# EAGLE schematic Battery Buddy Schematic V1 (NO STORAGE) (EAGLE 9.7.0)
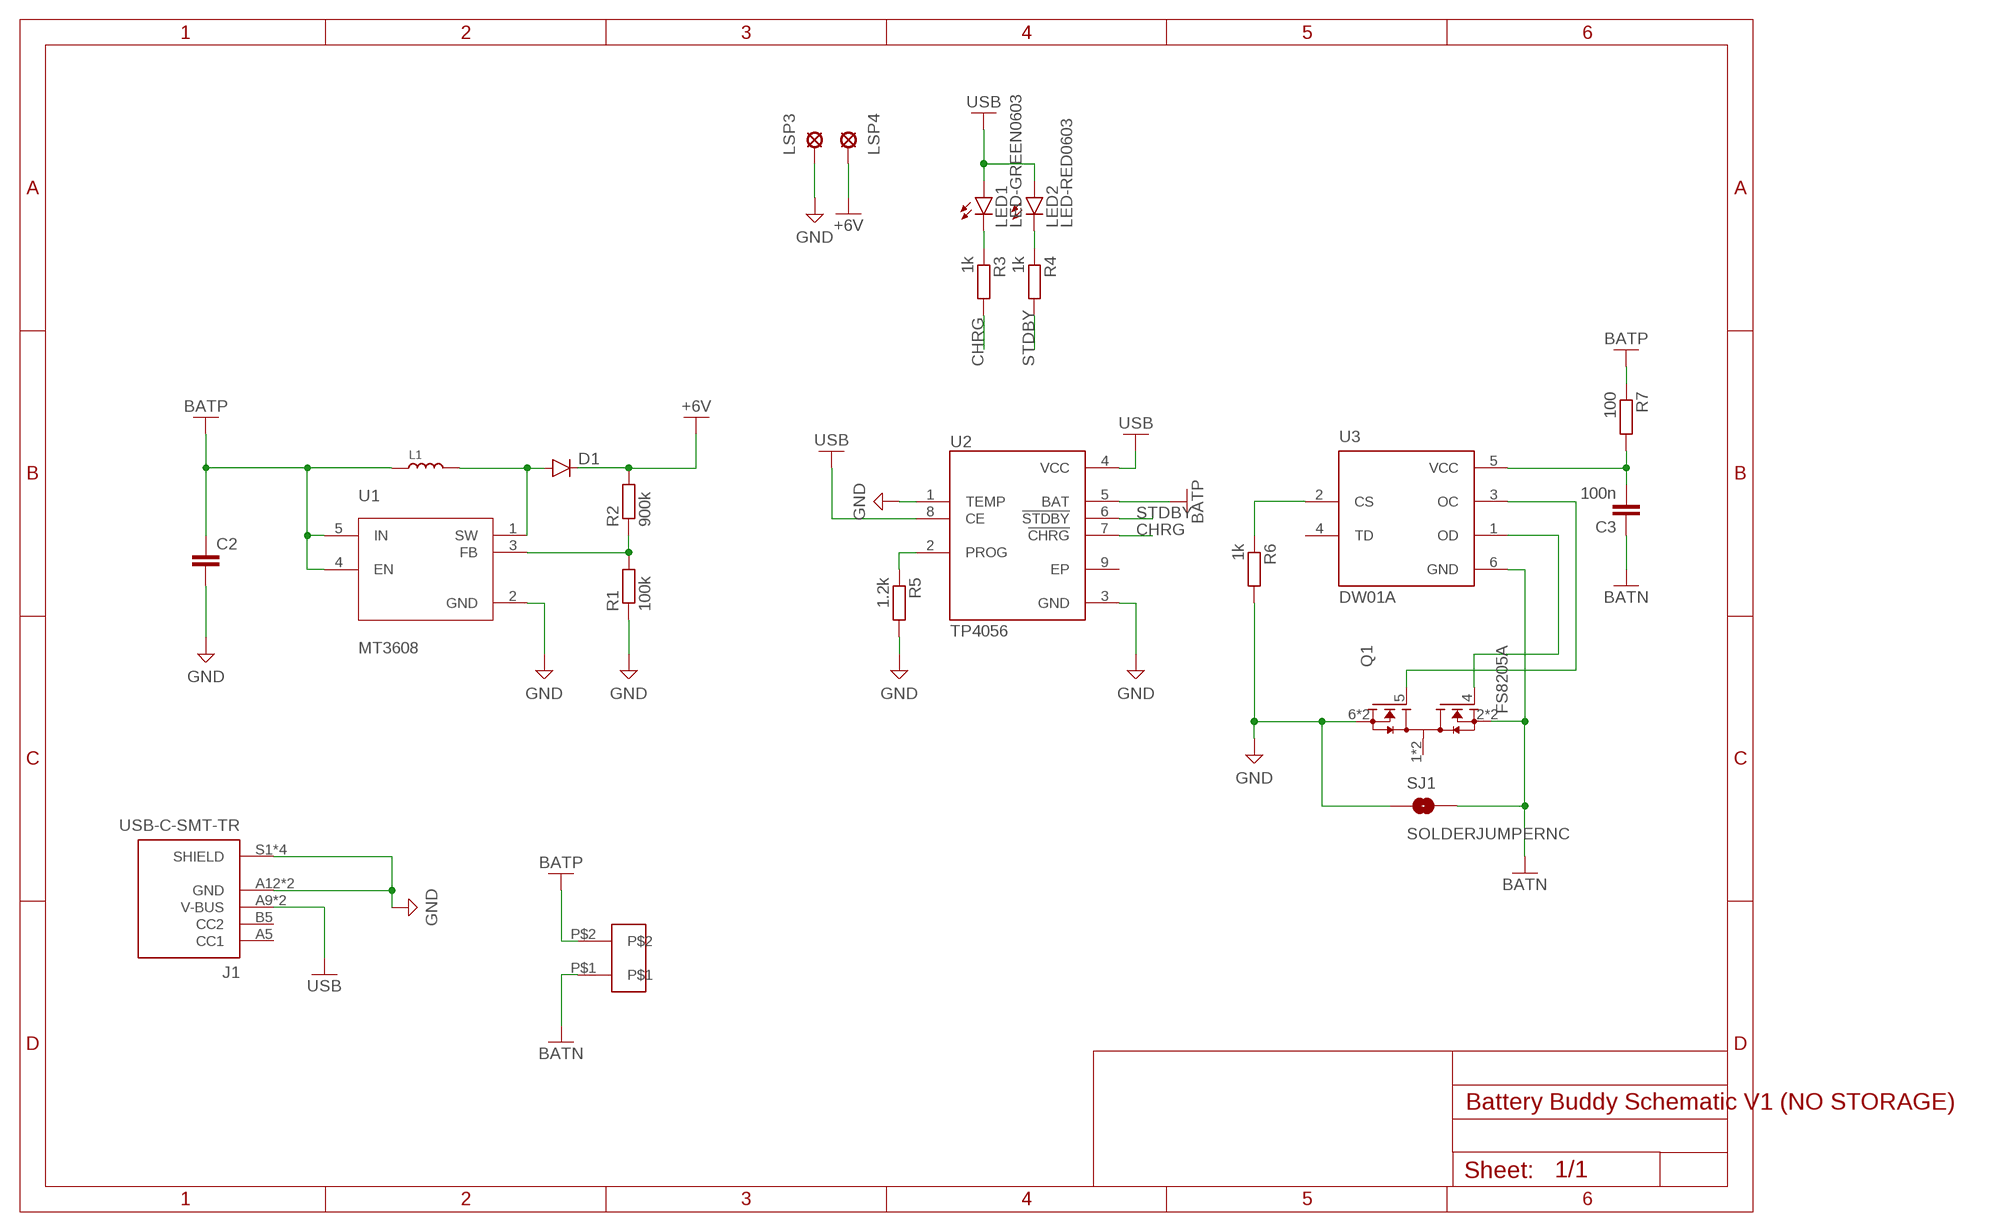
[diagram p0: schematic, sheet 1]

## Parts
C2  C-EUC0603  [C0603]
C3  100n  C-EUC0603  [C0603]
D1  DIODEDO214AA  [DO-214AA]
J1  USB-C-SMT-TR  [CUI_UJC-HP-3-SMT-TR]
L1  INDUCTOR/FERRITE-BEAD0630  [INDUCTOR_L0630]
LED1  LED-GREEN0603  [0603-GREEN]
LED2  LED-RED0603  [0603-RED]
LSP3  LSP10  [LSP10]
LSP4  LSP10  [LSP10]
Q1  FS8205A  [SOP65P640X120-8N]
R1  100k  R-EU_R0603  [R0603]
R2  900k  R-EU_R0603  [R0603]
R3  1k  R-EU_R0603  [R0603]
R4  1k  R-EU_R0603  [R0603]
R5  1.2k  R-EU_R0603  [R0603]
R6  1k  R-EU_R0603  [R0603]
R7  100  R-EU_R0603  [R0603]
SJ1  SOLDERJUMPERNC  [SJ_2S]
U1  MT3608  [SOT95P280X145-6N]
U2  TP4056  [SOP127P600X175-9N]
U3  DW01A  [SOT95P280X145-6N]
U$1  JST-ZH-2P  [JST-ZH-2P]

## Nets
+6V [POWER]: D1.C LSP4.MP R2.2
BATN [POWER]: C3.1 Q1.2(S1) Q1.3(S1) SJ1.2 U3.6(GND) U$1.P$1
BATP [POWER]: C2.1 L1.1 R7.1 U1.4(EN) U1.5(IN) U2.5(BAT) U$1.P$2
CHRG: R3.2 U2.7(!CHRG)
GND [POWER]: C2.2 J1.A12(GND) J1.B12(GND) J1.S1(SHIELD) J1.S2(SHIELD) J1.S3(SHIELD) J1.S4(SHIELD) LSP3.MP Q1.6(S2) Q1.7(S2) R1.1 R5.2 R6.2 SJ1.1 U1.2(GND) U2.1(TEMP) U2.3(GND)
N$1: LED1.C R3.1
N$2: LED2.C R4.1
N$3: R5.1 U2.2(PROG)
N$4: R6.1 U3.2(CS)
N$5: Q1.4(G1) U3.1(OD)
N$6: Q1.5(G2) U3.3(OC)
N$7: C3.2 R7.2 U3.5(VCC)
N$8 [POWER]: D1.A L1.2 U1.1(SW)
N$9: R1.2 R2.1 U1.3(FB)
STDBY: R4.2 U2.6(!STDBY)
USB [POWER]: J1.A9(V-BUS) J1.B9(V-BUS) LED1.A LED2.A U2.4(VCC) U2.8(CE)
Unconnected: J1.A5(CC1) J1.B5(CC2) Q1.1(D12) Q1.8(D12) U2.9(EP) U3.4(TD)

## Library data of the parts
C2 C3 = rcl:C-EU: CAPACITOR, European symbol; SPICEPREFIX: C
D1 = BeagleBone_Blue_R3:DIODE: Diode These are standard reverse protection diodes and small signal diodes. SMA package can handle up to about 1A. SOD-323 can handle about 200mA. What the SOD-323 package when ordering, there are some mfgs out there that are 5-pin packages.
J1 = USB-C-SMT-TR:USB-C-SMT-TR: Check availability <https://pricing.snapeda.com/parts/UJC-HP-3-SMT-TR/Same%20Sky/view-part?ref=eda>; AVAILABILITY: In Stock; CHECK_PRICES: https://www.snapeda.com/parts/UJC-HP-3-SMT-TR/Same+Sky/view-part/?ref=eda; DESCRIPTION: Type C, 20 Vdc, 3 A, Right Angle, Surface Mount, Black Insulator, Power-Only USB Receptacle; MF: Same Sky; MP: UJC-HP-3-SMT-TR; PACKAGE: Package; PRICE: None; SNAPEDA_LINK: https://www.snapeda.com/parts/UJC-HP-3-SMT-TR/Same+Sky/view-part/?ref=snap
L1 = BeagleBone_Blue_R3:INDUCTOR/FERRITE-BEAD
LED1 = BeagleBone_Blue_R3:LED-GREEN
LED2 = BeagleBone_Blue_R3:LED-RED
LSP3 LSP4 = solpad:LSP10: SOLDER PAD drill 1.0 mm, distributor Buerklin, 12H555
Q1 = FS8205A:FS8205A: Check availability <https://pricing.snapeda.com/parts/FS8205A/Fortune%20Semiconductor/view-part?ref=eda>; AVAILABILITY: In Stock; CHECK_PRICES: https://www.snapeda.com/parts/FS8205A/Fortune+Semiconductor/view-part/?ref=eda; MF: Fortune Semiconductor; MP: FS8205A; PACKAGE: Package; PRICE: None; SNAPEDA_LINK: https://www.snapeda.com/parts/FS8205A/Fortune+Semiconductor/view-part/?ref=snap
R1-R7 = rcl:R-EU_: RESISTOR, European symbol; SPICEPREFIX: R
SJ1 = SparkFun-Retired:SOLDERJUMPER: Solder Jumper Standard SMD solder jumper. Used to automate production. Two varients : Normally Open and Normally Closed are the same, but have different paste layers. NC will have a large amount of paste and should jumper during reflow.
U1 = MT3608:MT3608: Check availability <https://pricing.snapeda.com/parts/MT3608/Aerosemi%20Technology%20Co.%2C%20Ltd/view-part?ref=eda>; AVAILABILITY: Not in stock; CHECK_PRICES: https://www.snapeda.com/parts/MT3608/Aerosemi+Technology+Co.%252C+Ltd/view-part/?ref=eda; DESCRIPTION: High Efficiency 1.2MHz 2A Step Up Converter; MF: Aerosemi Technology Co., Ltd; MP: MT3608; PACKAGE: Package; PRICE: None; SNAPEDA_LINK: https://www.snapeda.com/parts/MT3608/Aerosemi+Technology+Co.%252C+Ltd/view-part/?ref=snap
U2 = TP4056:TP4056: Check availability <https://pricing.snapeda.com/parts/TP4056/NanJing%20Top%20Power%20ASIC%20Corp./view-part?ref=eda>; AVAILABILITY: Not in stock; CHECK_PRICES: https://www.snapeda.com/parts/TP4056/NanJing+Top+Power+ASIC+Corp./view-part/?ref=eda; DESCRIPTION: Complete single cell Li-Ion battery with a constant current / constant voltage linear charger; MF: NanJing Top Power ASIC Corp.; MP: TP4056; PACKAGE: Package; PRICE: None; SNAPEDA_LINK: https://www.snapeda.com/parts/TP4056/NanJing+Top+Power+ASIC+Corp./view-part/?ref=snap
U3 = DW01A:DW01A: Check availability <https://pricing.snapeda.com/parts/DW01A/Fortune%20Semiconductor/view-part?ref=eda>; AVAILABILITY: Not in stock; CHECK_PRICES: https://www.snapeda.com/parts/DW01A/Fortune+Semiconductor/view-part/?ref=eda; DESCRIPTION: One Cell Lithium-ion/Polymer Battery Protection IC; MF: Fortune Semiconductor; MP: DW01A; PACKAGE: SOT-23-6 Fortune Semiconductor; PRICE: None; SNAPEDA_LINK: https://www.snapeda.com/parts/DW01A/Fortune+Semiconductor/view-part/?ref=snap
U$1 = JST-ZH:JST-ZH-2P

## Net classes
1 POWER: width 0.305 mm